# EAGLE design ESPWaterMeter (EAGLE 9.6.2)
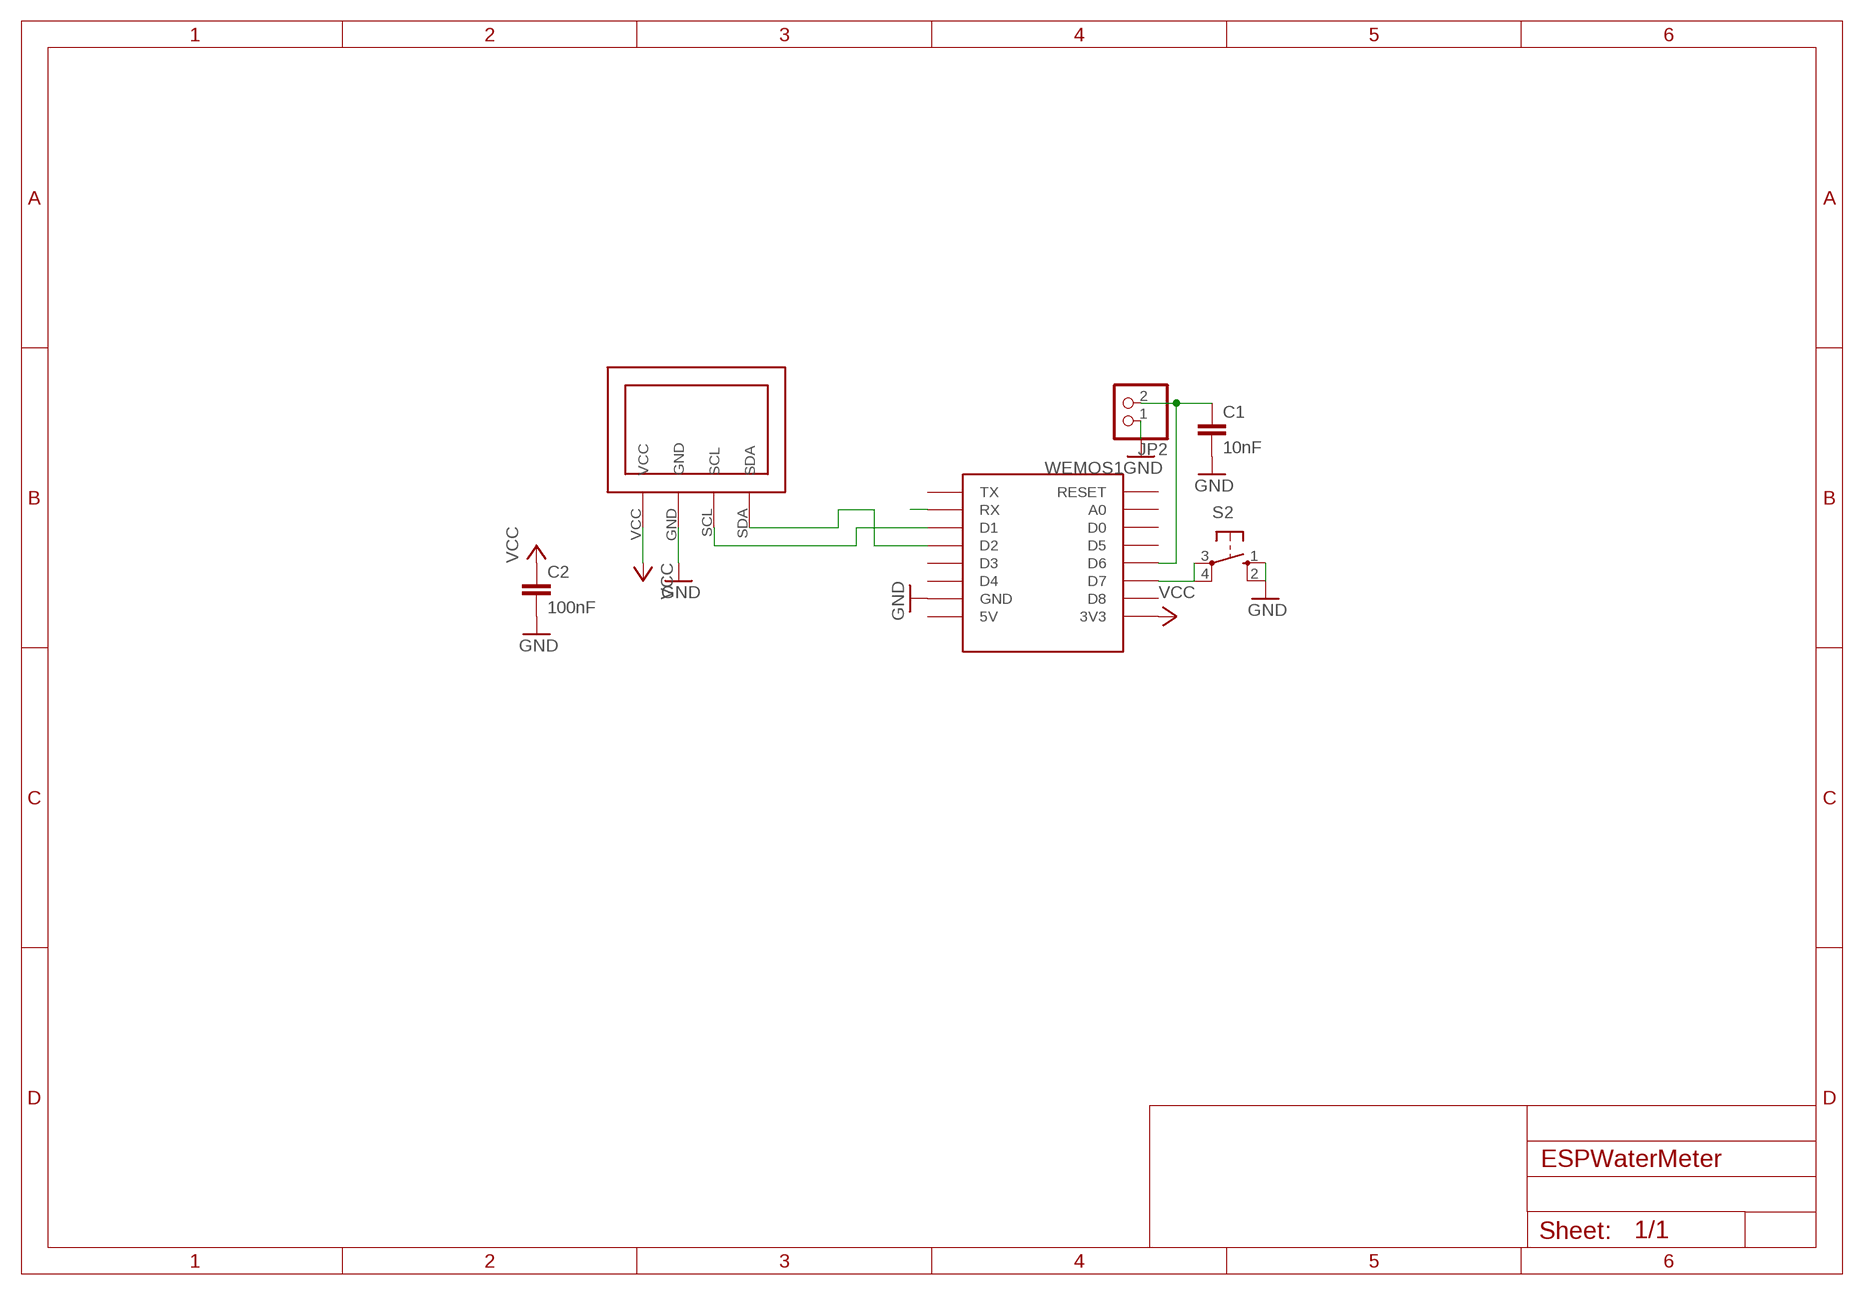
[diagram p0: schematic, sheet 1]

## Parts
C1  10nF  C-EU025-025X050  [C025-025X050]
C2  100nF  C-EU025-025X050  [C025-025X050]
JP2  PINHD-1X2  [1X02]
S2  10-XX  [B3F-10XX]
U$2  OLED128X64  [OLED128X64]
WEMOS1  WEMOS-D1-MINI  [WEMOS-D1-MINI]

## Nets
GND: C1.2 C2.2 JP2.1 S2.1(S) S2.2(S1) U$2.GND WEMOS1.GND
N$1: U$2.SDA WEMOS1.D2
N$2: S2.3(P) S2.4(P1) WEMOS1.D7
N$3: C1.1 JP2.2 WEMOS1.D6
N$6: WEMOS1.RX
N$18: U$2.SCL WEMOS1.D1
VCC: C2.1 U$2.VCC WEMOS1.3V3
Unconnected: WEMOS1.5V WEMOS1.A0 WEMOS1.D0 WEMOS1.D3 WEMOS1.D4 WEMOS1.D5 WEMOS1.D8 WEMOS1.RESET WEMOS1.TX

## Library data of the parts
C1 C2 = rcl:C-EU: CAPACITOR, European symbol
JP2 = pinhead:PINHD-1X2: PIN HEADER
S2 = switch-omron:10-XX: OMRON SWITCH; MPN: B3F-1000; OC_FARNELL: 176432; OC_NEWARK: 36M3542
U$2 = OLED 128x64:OLED128X64
WEMOS1 = esp8266modules:WEMOS-D1-MINI: WeMos.cc D1 mini ESP8266 module

## Board
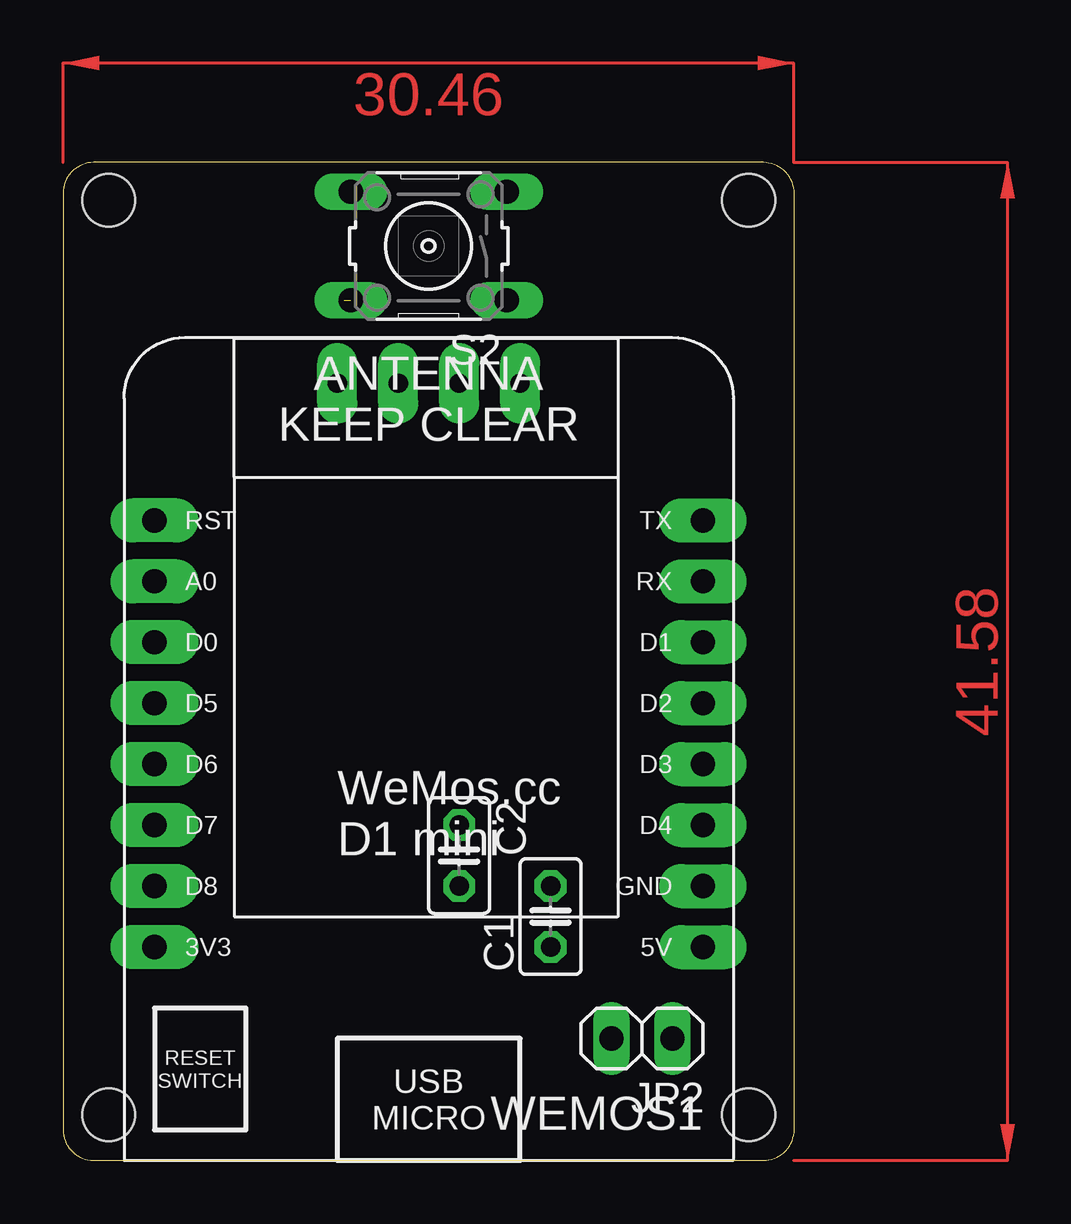
[diagram p1: board, top side]
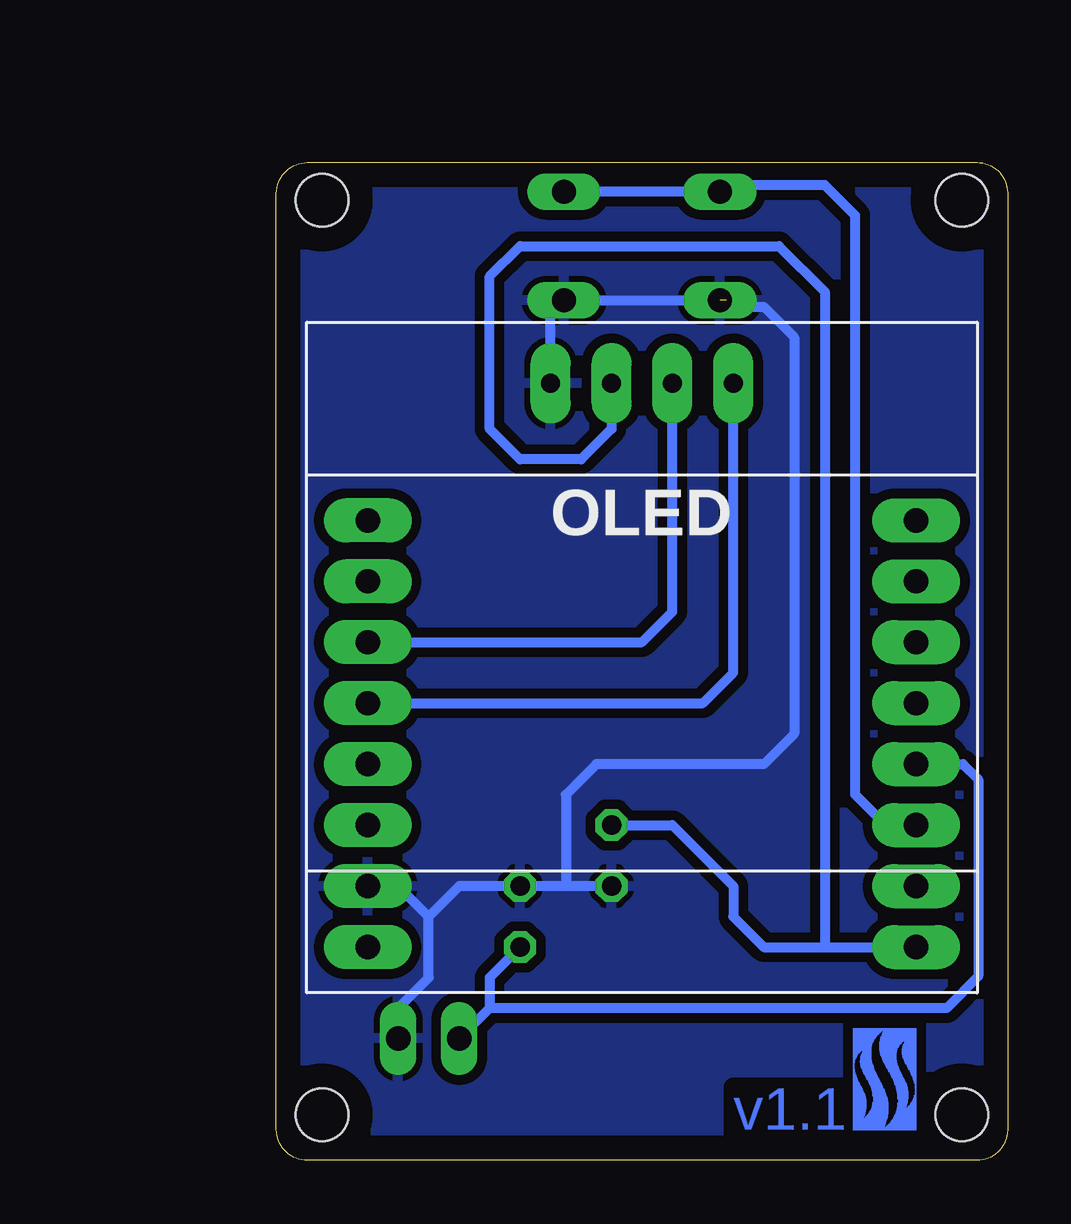
[diagram p2: board, bottom side, seen from below]

Size 30.48 x 41.58 mm. Coordinates in mm from the lower left corner, seen from the top.
Outline: 1.27,0 29.19,0 arc90 30.48,1.29 30.48,40.29 arc90 29.19,41.58 1.27,41.58 arc90 0,40.31 0,1.27 arc90 1.27,0
Copper layers (1*16): Top 0.035mm / dielectric 1.5mm / Bottom 0.035mm
Design rules "default": minimum track width 10mil, minimum drill 24mil, track to track 8mil, track to pad 8mil, pad to pad 8mil, via to via 8mil, smd to smd 8mil, copper to edge 40mil, drill to drill 8mil, minimum pad ring 10mil, minimum via ring 8mil, stop-mask expansion 4mil, vias tented up to drill 0mil, thermal gap 10mil
Holes 2.2 mm at 1.91,40.01 28.57,40.01 28.57,1.91 1.91,1.91

### Footprints (pad centres in the part's own frame; a part is rotated, then mirrored left to right if it is on the bottom)
C025-025X050 = drill 0.813 octagon: 1 -1.27,0; 2 1.27,0
1X02 = drill 1.016 long: 1 -1.27,0; 2 1.27,0
B3F-10XX = drill 1.016 long: 1 -3.251,2.261; 2 3.251,2.261; 3 -3.251,-2.261; 4 3.251,-2.261
OLED128X64 = drill 0.8 pad 1.676 long: GND -3.81,0; SCL 1.27,0; SDA 3.81,0; VCC -1.27,0
WEMOS-D1-MINI = drill 1.016 pad 1.829 long: 3V3 -10.16,-10.16; 5V 12.7,-10.16; A0 -10.16,5.08; D0 -10.16,2.54; D1 12.7,2.54; D2 12.7,0; D3 12.7,-2.54; D4 12.7,-5.08; D5 -10.16,0; D6 -10.16,-2.54; D7 -10.16,-5.08; D8 -10.16,-7.62; GND 12.7,-7.62; RESET -10.16,7.62; RX 12.7,5.08; TX 12.7,7.62

### Placement (x,y rotation side)
C1  20.32,10.16 90 top
C2  16.51,12.7 270 top
JP2  24.13,5.08 180 top
S2  15.24,38.1 180 top
U$1  [FB]  3.81,1.27 0 top
U$2  15.24,32.38 0 bottom
WEMOS1  13.97,19.05 0 top

### Tracks (layer width: path | path; a pad name or v marks a point on that pad's centre or on a via)
GND  (1 unrouted)
  Bottom 0.406: JP2.1 25.4,6.35 24.13,7.62 24.13,10.16 | 24.13,10.16 25.4,11.43 WEMOS1.GND | 24.13,10.16 22.86,11.43 C1.2 18.41,11.43 | C2.2 18.41,11.43 | U$2.GND 19.05,35.28 S2.1 11.71,35.84 11.43,35.56 10.16,35.56 8.89,34.29 8.89,17.78 10.16,16.51 17.14,16.51 18.41,15.24 18.41,11.43
  pour Bottom (isolate 0.406): 0,41.91 0,0 30.48,0 30.48,41.91
N$1
  Bottom 0.406: WEMOS1.D2 12.7,19.05 11.43,20.32 U$2.SDA
N$2
  Bottom 0.406: S2.3 S2.4 11.71,40.64 7.62,40.64 6.35,39.37 6.35,15.24 5.08,13.97 WEMOS1.D7
N$3
  Bottom 0.406: 21.59,6.35 2.54,6.35 1.22,7.67 1.22,15.88 1.85,16.51 WEMOS1.D6 | 21.59,6.35 JP2.2 | C1.1 21.59,7.62 21.59,6.35
N$18
  Bottom 0.406: WEMOS1.D1 15.24,21.59 13.97,22.86 U$2.SCL
VCC
  Bottom 0.406: C2.1 13.97,13.97 11.43,11.43 11.43,10.16 10.16,8.89 7.62,8.89 | 7.62,8.89 WEMOS1.3V3 | U$2.VCC 16.51,30.48 17.78,29.21 20.32,29.21 21.59,30.48 21.59,36.83 20.32,38.1 9.53,38.1 7.62,36.2 7.62,8.89
(copper drawn outside any net)
  shapes: Top area x2

### Text on the board
Bottom: v1.1